# EAGLE design design (EAGLE 9.5.2)
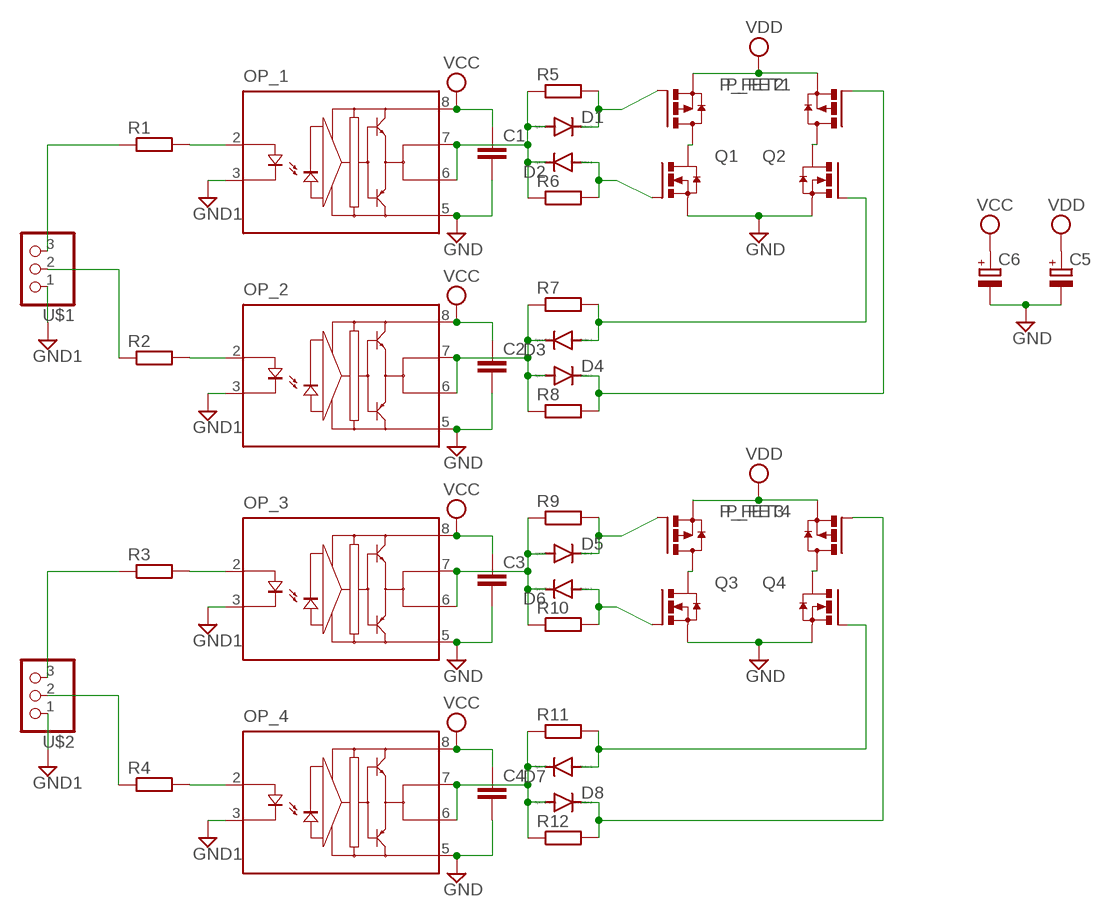
[diagram p0: schematic, sheet 1]

## Parts
C1  C-EU025-024X044  [C025-024X044]
C2  C-EU025-024X044  [C025-024X044]
C3  C-EU025-024X044  [C025-024X044]
C4  C-EU025-024X044  [C025-024X044]
C5  CPOL-EUE5-13  [E5-13]
C6  CPOL-EUE2.5-7  [E2,5-7]
D1  1N4148DO35-7  [DO35-7]
D2  1N4148DO35-7  [DO35-7]
D3  1N4148DO35-7  [DO35-7]
D4  1N4148DO35-7  [DO35-7]
D5  1N4148DO35-7  [DO35-7]
D6  1N4148DO35-7  [DO35-7]
D7  1N4148DO35-7  [DO35-7]
D8  1N4148DO35-7  [DO35-7]
OP_1  TLP250F  [DIL08]
OP_2  TLP250F  [DIL08]
OP_3  TLP250F  [DIL08]
OP_4  TLP250F  [DIL08]
P_FET1  P_D2PAK  [D2PACK]
P_FET2  P_D2PAK  [D2PACK]
P_FET3  P_D2PAK  [D2PACK]
P_FET4  P_D2PAK  [D2PACK]
Q1  IRF3704S  [D2PACK]
Q2  IRF3704S  [D2PACK]
Q3  IRF3704S  [D2PACK]
Q4  IRF3704S  [D2PACK]
R1  R-EU_0207/7  [0207/7]
R2  R-EU_0207/7  [0207/7]
R3  R-EU_0207/7  [0207/7]
R4  R-EU_0207/7  [0207/7]
R5  R-EU_0207/7  [0207/7]
R6  R-EU_0207/7  [0207/7]
R7  R-EU_0207/7  [0207/7]
R8  R-EU_0207/7  [0207/7]
R9  R-EU_0207/7  [0207/7]
R10  R-EU_0207/7  [0207/7]
R11  R-EU_0207/7  [0207/7]
R12  R-EU_0207/7  [0207/7]
U$1  ABOUTERS_3PIN  [22-23-2031]
U$2  ABOUTERS_3PIN  [22-23-2031]

## Nets
GND: C1.2 C2.2 C3.2 C4.2 C5.- C6.- OP_1.5(GND) OP_2.5(GND) OP_3.5(GND) OP_4.5(GND) Q1.3(S) Q2.3(S) Q3.3(S) Q4.3(S)
GND1: OP_1.3(K) OP_2.3(K) OP_3.3(K) OP_4.3(K) U$1.1 U$2.1
N$1: R1.1 U$1.3
N$2: OP_1.2(A) R1.2
N$3: R2.1 U$1.2
N$4: OP_2.2(A) R2.2
N$5: D1.A D2.C OP_1.6(VO) OP_1.7(VO') R5.1 R6.1
N$6: D3.C D4.A OP_2.6(VO) OP_2.7(VO') R7.1 R8.1
N$7: R3.1 U$2.3
N$8: OP_3.2(A) R3.2
N$9: R4.1 U$2.2
N$10: OP_4.2(A) R4.2
N$11: D5.A D6.C OP_3.6(VO) OP_3.7(VO') R9.1 R10.1
N$12: D7.C D8.A OP_4.6(VO) OP_4.7(VO') R11.1 R12.1
N$13: P_FET2.2(D) Q1.2(D)
N$14: D1.C P_FET2.1(G) R5.2
N$15: P_FET1.2(D) Q2.2(D)
N$16: D2.A Q1.1(G) R6.2
N$18: P_FET3.2(D) Q3.2(D)
N$19: D3.A Q2.1(G) R7.2
N$20: D5.C P_FET3.1(G) R9.2
N$21: D4.C P_FET1.1(G) R8.2
N$22: P_FET4.2(D) Q4.2(D)
N$23: D6.A Q3.1(G) R10.2
N$24: D8.C P_FET4.1(G) R12.2
N$26: D7.A Q4.1(G) R11.2
VCC: C1.1 C2.1 C3.1 C4.1 C6.+ OP_1.8(VCC) OP_2.8(VCC) OP_3.8(VCC) OP_4.8(VCC)
VDD: C5.+ P_FET1.3(S) P_FET2.3(S) P_FET3.3(S) P_FET4.3(S)

## Library data of the parts
C1-C4 = rcl:C-EU: CAPACITOR, European symbol; SPICEPREFIX: C
C5 C6 = rcl:CPOL-EU: POLARIZED CAPACITOR, European symbol; SPICEPREFIX: C
D1-D8 = diode:1N4148: DIODE high speed (Philips)
OP_1-OP_4 = optocoupler-3-jcn:TLP250F: Toshiba Transistor Inverter Inverter For Air Conditionor IGBT Gate Drive Power MOS FET Gate Drive
P_FET1-P_FET4 = transistor-power:P_D2PAK
Q1-Q4 = transistor-power:IRF3704: SMPS MOSFET HEXFET® Power MOSFET Source: http://www.irf.com/product-info/datasheets/data/irf3704.pdf
R1-R12 = rcl:R-EU_: RESISTOR, European symbol; SPICEPREFIX: R
U$1 U$2 = abouters_pin (1):ABOUTERS_3PIN

## Board
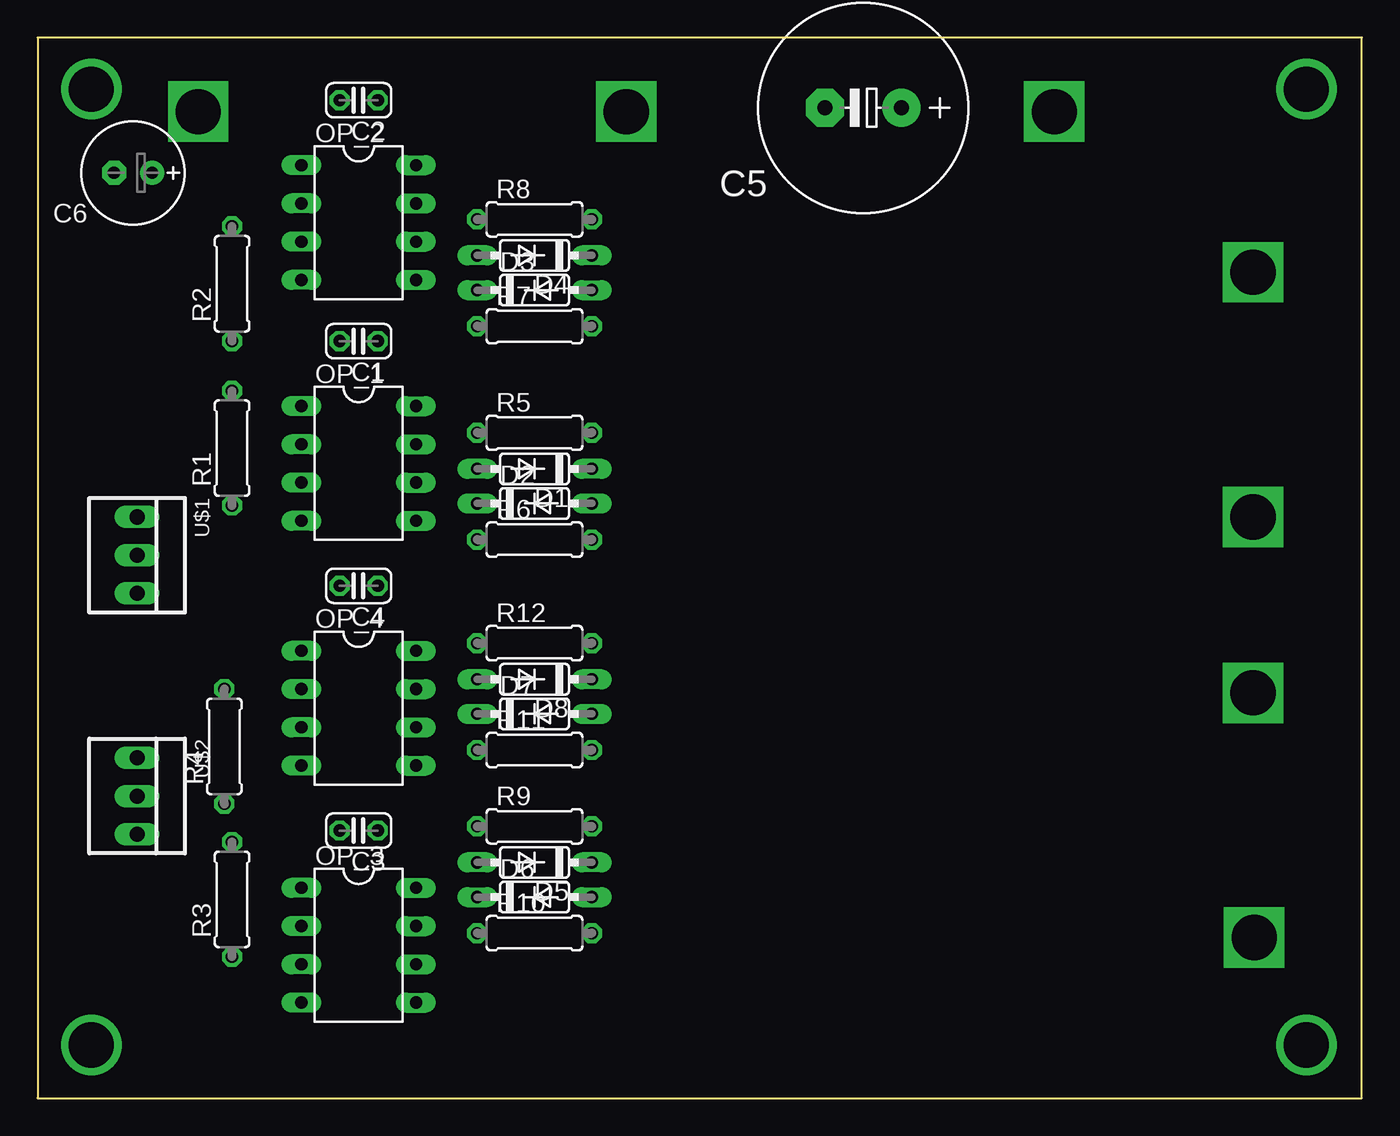
[diagram p1: board, top side]
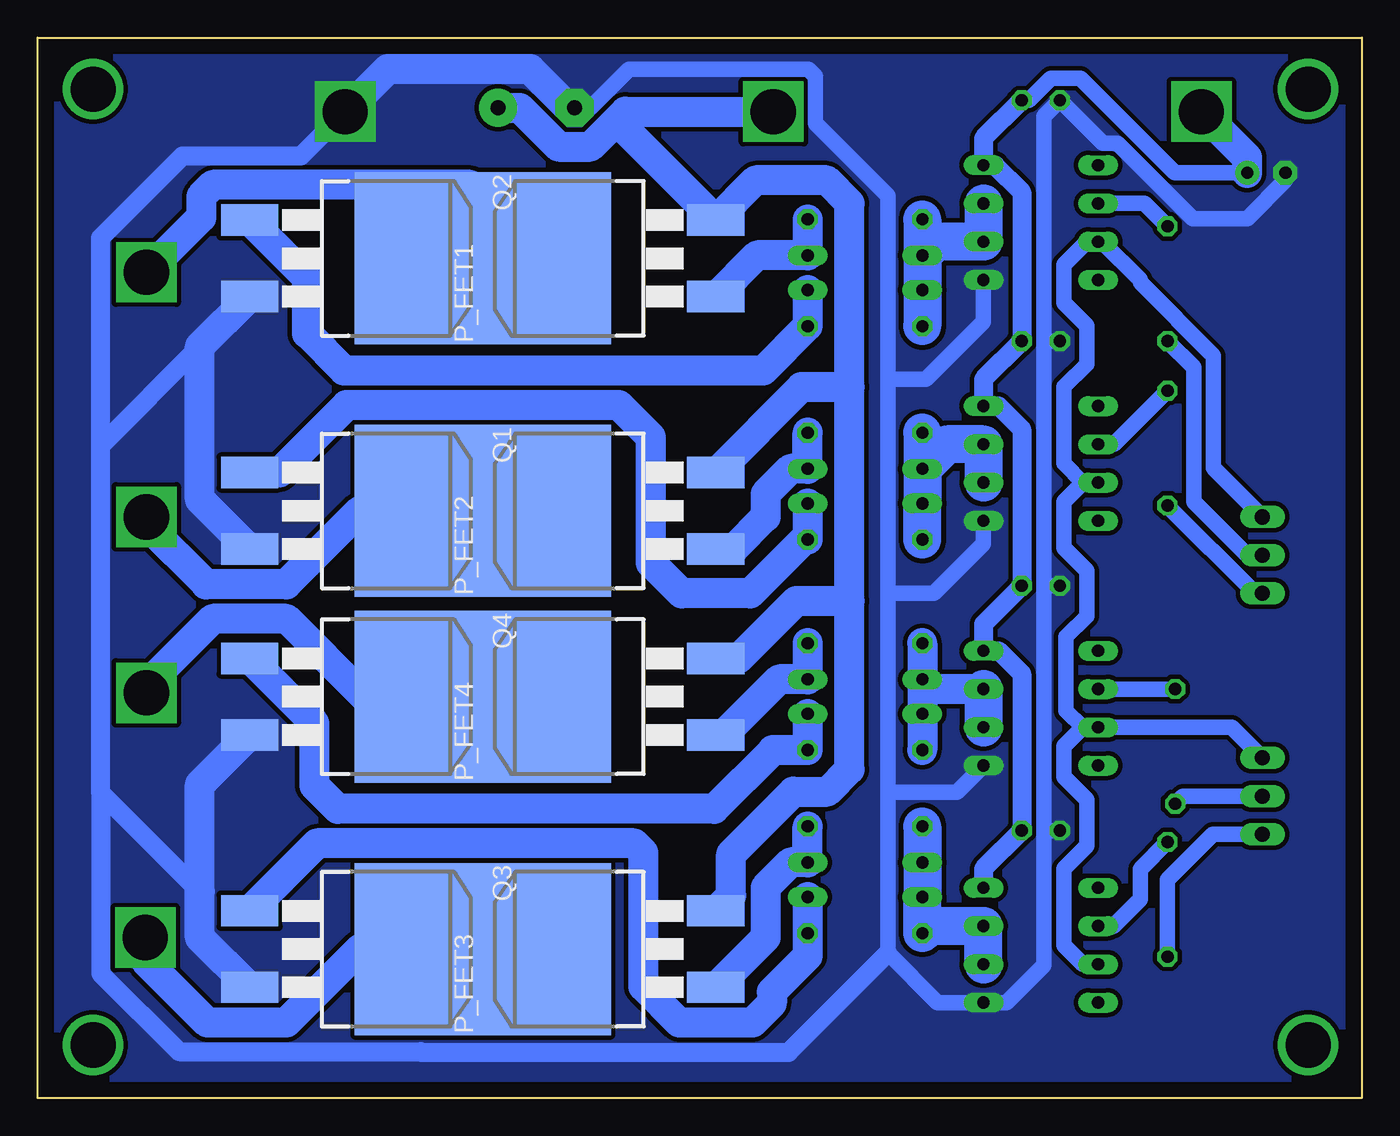
[diagram p2: board, bottom side, seen from below]

Size 88 x 70.45 mm. Coordinates in mm from the lower left corner, seen from the top.
Outline: 0,0 88,0 88,70.45 0,70.45 0,0
Copper layers (1*16): Top 0.035mm / dielectric 1.5mm / Bottom 0.035mm
Design rules "default *": minimum track width 6mil, minimum drill 0.35mm, track to track 0.3mm, track to pad 0.3mm, pad to pad 0.3mm, via to via 0.3mm, smd to smd 0.3mm, copper to edge 40mil, drill to drill 6mil, minimum pad ring 10mil, minimum via ring 8mil, stop-mask expansion 4mil, vias tented up to drill 0mil, thermal gap 10mil

### Footprints (pad centres in the part's own frame; a part is rotated, then mirrored left to right if it is on the bottom)
C025-024X044 = drill 0.813 octagon: 1 -1.27,0; 2 1.27,0
E5-13 = drill 1.016 pad 2.54: + -2.54,0 | drill 1.016 pad 2.54 octagon: - 2.54,0
E2,5-7 = drill 0.813 pad 1.6: + -1.27,0 | drill 0.813 pad 1.6 octagon: - 1.27,0
DO35-7 = drill 0.813 long: A 3.81,0; C -3.81,0
DIL08 = drill 0.813 long: 1 -3.81,-3.81; 2 -1.27,-3.81; 3 1.27,-3.81; 4 3.81,-3.81; 5 3.81,3.81; 6 1.27,3.81; 7 -1.27,3.81; 8 -3.81,3.81
D2PACK = smd 2.083 x 3.81: 1 -2.54,-8.89; 3 2.54,-8.89 | smd 11.43 x 8.89: 2 0,2.54
0207/7 = drill 0.813 octagon: 1 -3.81,0; 2 3.81,0
22-23-2031 = drill 1 long: 1 -2.54,0; 2 0,0; 3 2.54,0

### Placement (x,y rotation side)
C1  21.34,50.29 180 top
C2  21.34,66.29 180 top
C3  21.34,17.78 180 top
C4  21.34,34.04 180 top
C5  54.86,65.79 180 top
C6  6.35,61.47 180 top
D1  33.02,41.8 180 top
D2  33.02,39.5 0 top
D3  33.02,53.68 0 top
D4  33.02,55.98 180 top
D5  33.02,15.66 180 top
D6  33.02,13.36 0 top
D7  33.02,25.53 0 top
D8  33.02,27.83 180 top
OP_1  21.34,42.16 270 top
OP_2  21.34,58.17 270 top
OP_3  21.34,10.16 270 top
OP_4  21.34,25.91 270 top
P_FET1  51.82,55.78 90 bottom
P_FET2  51.82,39.02 90 bottom
P_FET3  51.82,9.91 90 bottom
P_FET4  51.82,26.67 90 bottom
Q1  65.02,39.02 270 bottom
Q2  65.02,55.78 270 bottom
Q3  65.02,9.91 270 bottom
Q4  65.02,26.67 270 bottom
R1  12.92,43.18 90 top
R2  12.92,54.1 90 top
R3  12.92,13.21 90 top
R4  12.41,23.37 90 top
R5  33.02,44.2 0 top
R6  33.02,37.1 0 top
R7  33.02,51.28 0 top
R8  33.02,58.38 0 top
R9  33.02,18.06 0 top
R10  33.02,10.96 0 top
R11  33.02,23.13 0 top
R12  33.02,30.23 0 top
U$1  6.6,36.07 270 top
U$2  6.6,20.07 270 top

### Tracks (layer width: path | path; a pad name or v marks a point on that pad's centre or on a via)
GND  (via drill 3)
  Bottom 1.016: 21.13,50.34 21.08,50.29 C1.2 | 21.13,50.34 21.13,65.23 C2.2 17.22,63.44 16.26,63.44 11.23,58.42 7.62,58.42 5.08,60.96 C6.- | 21.13,50.34 21.13,34.24 | 21.13,34.24 21.14,34.23 21.14,34.04 C4.2 | 21.13,34.24 21.13,17.99 | 21.13,17.99 21.14,17.98 21.14,17.78 C3.2 | OP_2.5 25.15,51.56 28.96,47.75 31.5,47.75 | 31.5,47.75 31.5,33.53 | OP_1.5 25.15,36.83 28.45,33.53 31.5,33.53 | 31.5,20.32 31.5,9.65 28.19,6.35 OP_3.5 23.62,6.35 21.13,8.84 21.13,17.99 | 31.5,20.32 31.5,33.53 | 31.5,20.32 26.92,20.32 OP_4.5 | C5.- 51.25,65.79 48.68,68.35 36.77,68.35 36.3,67.88 36.3,64.75 31.5,59.94 31.5,47.75
  Bottom 1.27: 77.22,49.94 83.82,43.34 | 83.82,43.34 83.82,20.32 83.79,20.29 | 77.22,13.72 83.79,20.29 | v67.56,65.53 70.5,62.6 78.37,62.6 83.82,57.15 83.82,43.34 | 83.79,20.29 83.79,8.27 78.61,3.09 62.53,3.09 62.48,3.05 38.1,3.05 31.5,9.65
  Bottom 2: Q4.3 77.22,20.83 77.22,13.72 77.22,10.67 Q3.3 | Q1.3 77.22,39.78 77.22,49.94 Q2.3 | C5.- 52.71,65.79 55.28,68.36 64.74,68.36 v67.56,65.53
  pour Bottom (no thermals): 0,70.61 0,0 87.88,0 87.88,70.61
GND1
  Bottom 1.016: 18.54,40.89 19.81,42.16 19.81,47.24 18.29,48.77 18.29,51.31 19.81,52.83 19.81,55.37 18.29,56.9 OP_2.3 17.27,56.9 14.73,54.36 14.73,54.19 9.86,49.31 9.86,41.86 U$1.1 | OP_3.3 18.54,8.89 19.81,10.16 19.81,15.24 18.29,16.76 18.29,19.81 19.81,21.34 19.81,23.37 18.54,24.64 | 18.54,24.64 OP_4.3 8.64,24.64 U$2.1 | OP_1.3 18.54,40.89 | 18.54,40.89 19.81,39.62 19.81,36.58 18.29,35.05 18.29,32 19.66,30.64 19.66,25.75 18.54,24.64
N$1
  Bottom 1.016: U$1.3 7.07,33.53 R1.1
N$2
  Bottom 1.016: R1.2 16.47,43.43 OP_1.2
N$3
  Bottom 1.016: R2.1 11.18,48.55 11.18,39.62 7.62,36.07 U$1.2
N$4
  Bottom 1.016: R2.2 14.44,59.44 OP_2.2
N$5
  Bottom 2.54: OP_1.6 OP_1.7 27.58,43.43 D1.A | R5.1 D1.A | D1.A D2.C R6.1
N$6
  Bottom 2.54: OP_2.7 OP_2.6 28.29,56.9 D4.A | R8.1 D4.A | D4.A D3.C R7.1
N$7
  Bottom 1.016: U$2.3 9.91,17.53 12.92,14.52 R3.1
N$8
  Bottom 1.016: R3.2 14.73,15.2 14.73,13.21 16.51,11.43 OP_3.2
N$9
  Bottom 1.016: U$2.2 11.9,20.07 R4.1
N$10
  Bottom 1.016: R4.2 OP_4.2
N$11
  Bottom 2.54: OP_3.6 OP_3.7 28.74,11.43 R10.1 D6.C D5.A R9.1
N$12
  Bottom 2: R12.1 D8.A | D8.A D7.C R11.1 | OP_4.7 28.56,27.18 D8.A
  Bottom 2.54: OP_4.7 OP_4.6
N$13  (via drill 3)
  Bottom 2: Q1.2 P_FET2.2 66.59,39.02 71.47,34.14 76.81,34.14 80.77,38.1 v80.77,38.61
N$14
  Bottom 2: R5.2 D1.C 37.96,41.8 39.62,40.14 39.62,38.61 41.75,36.48 P_FET2.1
N$15  (via drill 3)
  Bottom 2: Q2.2 P_FET1.2 59.24,60.66 76.36,60.66 77.12,59.9 77.12,58.52 v80.77,54.86
N$16
  Bottom 2: D2.A R6.2 37.06,37.1 40.64,33.53 45.21,33.53 47.24,35.56 47.24,43.91 49.37,46.03 67.47,46.03 71.94,41.56 Q1.1
N$17  (via drill 3)
  other vias: 3.57,3.53
N$18  (via drill 3)
  Bottom 2: P_FET3.2 Q3.2 66.59,9.91 71.47,5.03 76.73,5.03 80.85,9.14 v80.85,10.67
N$19
  Bottom 2: D3.A R7.2 39.77,48.34 67.64,48.34 70.1,50.8 70.1,54.51 Q2.1
N$20
  Bottom 2: R9.2 D5.C 37.96,15.66 39.62,14 39.62,10.67 P_FET3.1
N$21
  Bottom 2: R8.2 D4.C 40.19,55.98 P_FET1.1
N$22  (via drill 3)
  Bottom 2: Q4.2 P_FET4.2 66.29,26.67 71.46,31.84 76.36,31.84 80.77,27.43 v80.77,26.92
N$23
  Bottom 2: D6.A R10.2 36.83,9.44 39.21,7.05 39.21,6.29 40.48,5.03 45.37,5.03 47.75,7.41 47.75,16.32 48.36,16.92 69.44,16.92 Q3.1
N$24
  Bottom 2: R12.2 D8.C 38.72,27.83 42.42,24.13 P_FET4.1
N$25  (via drill 3)
  other vias: 84.32,3.53
N$26
  Bottom 2: D7.A R11.2 39.14,23.13 43.05,19.22 68.05,19.22 69.6,20.77 69.6,24.89 Q4.1
N$27  (via drill 3)
  other vias: 84.32,67.03
N$28  (via drill 3)
  other vias: 3.57,67.03
VCC  (via drill 3)
  Bottom 1.016: C6.+ 12.42,61.47 18.71,67.76 20.67,67.76 22.14,66.29 C2.1
  Bottom 1.27: C2.1 25.15,63.75 OP_2.8 24.38,61.98 22.61,60.2 C1.1 25.15,47.75 OP_1.8 24.13,45.97 22.61,44.45 C4.1 25.15,31.5 OP_4.8 24.13,29.72 22.61,28.19 C3.1 25.15,15.24 OP_3.8
  Bottom 2: C6.+ 7.62,62.48 v10.67,65.53
VDD  (via drill 3)
  Bottom 2: P_FET3.3 41.92,13.45 41.92,16.22 37.78,20.36 35.52,20.36 34.04,21.84 34.04,33.02 | P_FET4.3 41.4,29.21 37.59,33.02 34.04,33.02 | P_FET2.3 37.24,47.24 34.04,47.24 | 34.04,33.02 34.04,47.24 | 34.04,47.24 34.04,59.44 35.56,60.96 40.29,60.96 P_FET1.3 48.94,64.34 48.94,65.53 | C5.+ 55.96,65.79 53.39,63.22 51.26,63.22 48.94,65.53 | 48.94,65.53 v39.12,65.53